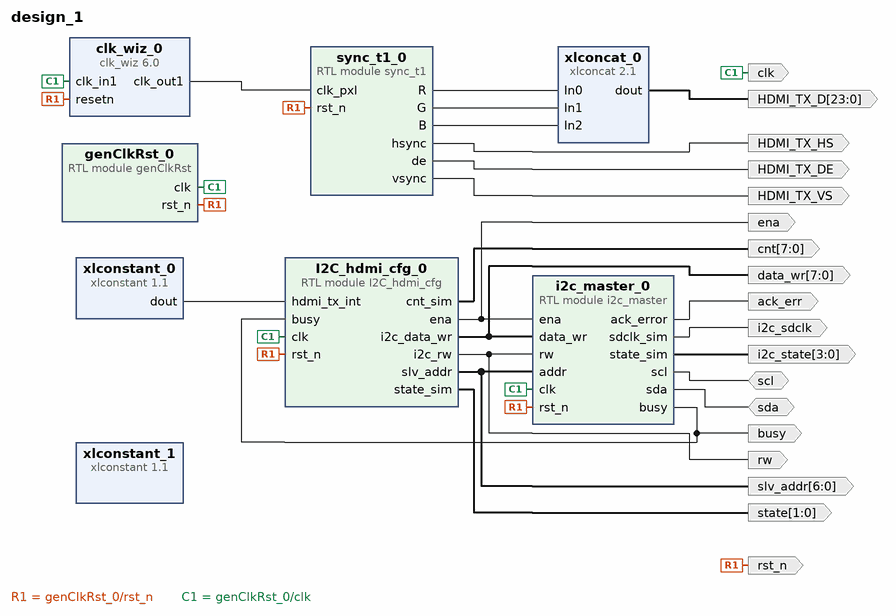
[diagram p0: block diagram of the top level]
# Vivado block design design_1, xc7k325tffg676-1, Vivado 2019.1
create_bd_design design_1

create_bd_port -dir O ena
create_bd_port -dir O -from 6 -to 0 slv_addr
create_bd_port -dir O rw
create_bd_port -dir O -from 7 -to 0 data_wr
create_bd_port -dir O -from 7 -to 0 cnt
create_bd_port -dir O clk
create_bd_port -dir O rst_n
create_bd_port -dir O -from 1 -to 0 state
create_bd_port -dir IO sda
create_bd_port -dir IO scl
create_bd_port -dir O busy
create_bd_port -dir O ack_err
create_bd_port -dir O -from 3 -to 0 i2c_state
create_bd_port -dir O i2c_sdclk
create_bd_port -dir O HDMI_TX_HS
create_bd_port -dir O HDMI_TX_VS
create_bd_port -dir O HDMI_TX_DE
create_bd_port -dir O -from 23 -to 0 HDMI_TX_D

create_bd_cell -type ip -vlnv xilinx.com:ip:xlconstant:1.1 xlconstant_0
set_property -dict {CONFIG.CONST_VAL 0} [get_bd_cells xlconstant_0]
create_bd_cell -type module -reference I2C_hdmi_cfg I2C_hdmi_cfg_0
create_bd_cell -type module -reference i2c_master i2c_master_0
create_bd_cell -type ip -vlnv xilinx.com:ip:xlconstant:1.1 xlconstant_1
set_property -dict {CONFIG.CONST_VAL 0 CONFIG.CONST_WIDTH 8} [get_bd_cells xlconstant_1]
create_bd_cell -type ip -vlnv xilinx.com:ip:xlconcat:2.1 xlconcat_0
set_property -dict {CONFIG.IN0_WIDTH 8 CONFIG.IN1_WIDTH 8 CONFIG.IN2_WIDTH 8 CONFIG.NUM_PORTS 3} [get_bd_cells xlconcat_0]
create_bd_cell -type module -reference sync_t1 sync_t1_0
create_bd_cell -type ip -vlnv xilinx.com:ip:clk_wiz:6.0 clk_wiz_0
set_property -dict [list \
  CONFIG.CLKIN1_JITTER_PS 200.0 \
  CONFIG.CLKOUT1_JITTER 146.589 \
  CONFIG.CLKOUT1_PHASE_ERROR 157.402 \
  CONFIG.CLKOUT1_REQUESTED_OUT_FREQ 150.000 \
  CONFIG.MMCM_CLKFBOUT_MULT_F 19.875 \
  CONFIG.MMCM_CLKIN1_PERIOD 20.000 \
  CONFIG.MMCM_CLKIN2_PERIOD 10.0 \
  CONFIG.MMCM_CLKOUT0_DIVIDE_F 6.625 \
  CONFIG.MMCM_DIVCLK_DIVIDE 1 \
  CONFIG.PRIM_IN_FREQ 50.000 \
  CONFIG.RESET_PORT resetn \
  CONFIG.RESET_TYPE ACTIVE_LOW \
] [get_bd_cells clk_wiz_0]
create_bd_cell -type module -reference genClkRst genClkRst_0

# ---- connections ----

connect_bd_net [get_bd_pins genClkRst_0/rst_n] \
  [get_bd_ports rst_n] [get_bd_pins I2C_hdmi_cfg_0/rst_n] [get_bd_pins i2c_master_0/rst_n] [get_bd_pins clk_wiz_0/resetn] \
  [get_bd_pins sync_t1_0/rst_n]
connect_bd_net [get_bd_pins I2C_hdmi_cfg_0/ena] [get_bd_ports ena] [get_bd_pins i2c_master_0/ena]
connect_bd_net [get_bd_pins I2C_hdmi_cfg_0/slv_addr] [get_bd_ports slv_addr] [get_bd_pins i2c_master_0/addr]
connect_bd_net [get_bd_pins I2C_hdmi_cfg_0/i2c_rw] [get_bd_ports rw] [get_bd_pins i2c_master_0/rw]
connect_bd_net [get_bd_pins I2C_hdmi_cfg_0/i2c_data_wr] [get_bd_ports data_wr] [get_bd_pins i2c_master_0/data_wr]
connect_bd_net [get_bd_pins I2C_hdmi_cfg_0/cnt_sim] [get_bd_ports cnt]
connect_bd_net [get_bd_pins genClkRst_0/clk] \
  [get_bd_ports clk] [get_bd_pins I2C_hdmi_cfg_0/clk] [get_bd_pins i2c_master_0/clk] [get_bd_pins clk_wiz_0/clk_in1]
connect_bd_net [get_bd_pins I2C_hdmi_cfg_0/state_sim] [get_bd_ports state]
connect_bd_net [get_bd_ports sda] [get_bd_pins i2c_master_0/sda]
connect_bd_net [get_bd_ports scl] [get_bd_pins i2c_master_0/scl]
connect_bd_net [get_bd_pins xlconstant_0/dout] [get_bd_pins I2C_hdmi_cfg_0/hdmi_tx_int]
connect_bd_net [get_bd_pins i2c_master_0/busy] [get_bd_ports busy] [get_bd_pins I2C_hdmi_cfg_0/busy]
connect_bd_net [get_bd_pins i2c_master_0/ack_error] [get_bd_ports ack_err]
connect_bd_net [get_bd_pins i2c_master_0/state_sim] [get_bd_ports i2c_state]
connect_bd_net [get_bd_pins i2c_master_0/sdclk_sim] [get_bd_ports i2c_sdclk]
connect_bd_net [get_bd_pins sync_t1_0/hsync] [get_bd_ports HDMI_TX_HS]
connect_bd_net [get_bd_pins sync_t1_0/vsync] [get_bd_ports HDMI_TX_VS]
connect_bd_net [get_bd_pins sync_t1_0/de] [get_bd_ports HDMI_TX_DE]
connect_bd_net [get_bd_pins sync_t1_0/R] [get_bd_pins xlconcat_0/In0]
connect_bd_net [get_bd_pins sync_t1_0/G] [get_bd_pins xlconcat_0/In1]
connect_bd_net [get_bd_pins sync_t1_0/B] [get_bd_pins xlconcat_0/In2]
connect_bd_net [get_bd_pins xlconcat_0/dout] [get_bd_ports HDMI_TX_D]
connect_bd_net [get_bd_pins clk_wiz_0/clk_out1] [get_bd_pins sync_t1_0/clk_pxl]

validate_bd_design
save_bd_design
